# Altium schematic sheet RK3562-POWER-GND.SchDoc
size 299 x 209 mm; SheetNumber: 4; SheetTotal: 32
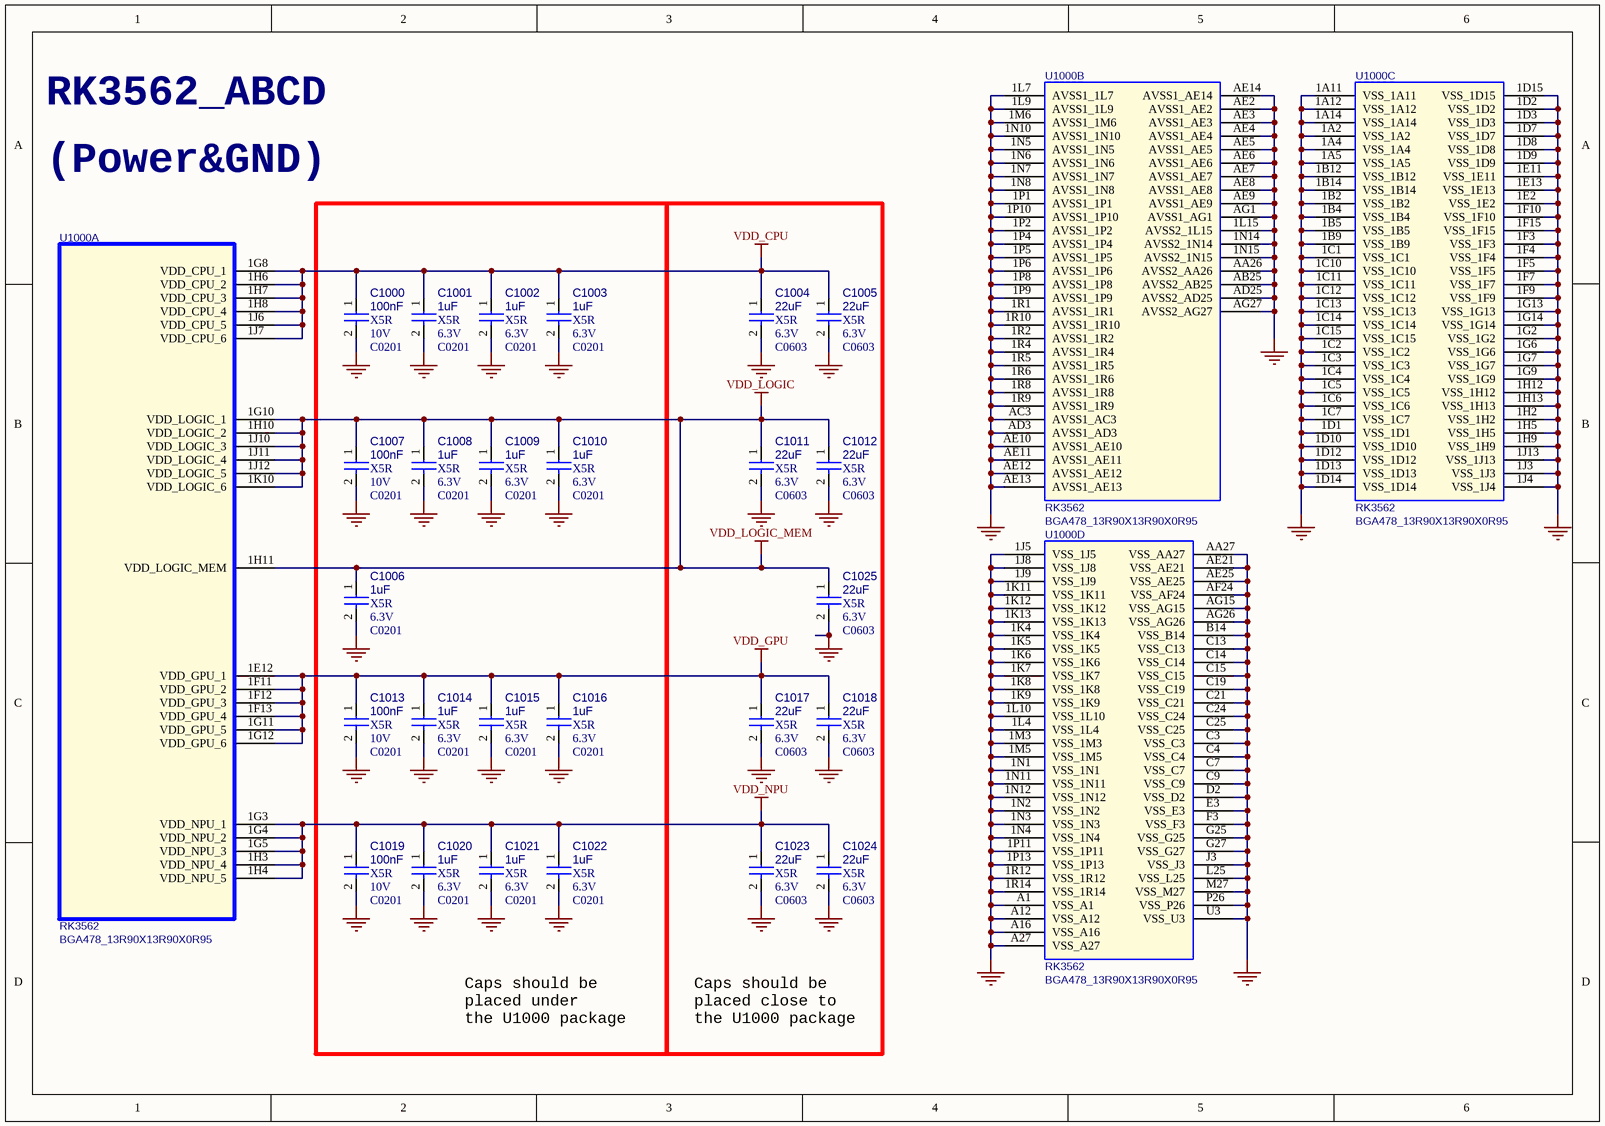
[diagram p0: RK3562-POWER-GND.SchDoc]

## Parts
C1000  100nF  Dielectric: X5R  Voltage: 10V  [C0201]
C1001  1uF  Dielectric: X5R  Voltage: 6.3V  [C0201]
C1002  1uF  Dielectric: X5R  Voltage: 6.3V  [C0201]
C1003  1uF  Dielectric: X5R  Voltage: 6.3V  [C0201]
C1004  22uF  Dielectric: X5R  Voltage: 6.3V  [C0603]
C1005  22uF  Dielectric: X5R  Voltage: 6.3V  [C0603]
C1006  1uF  Dielectric: X5R  Voltage: 6.3V  [C0201]
C1007  100nF  Dielectric: X5R  Voltage: 10V  [C0201]
C1008  1uF  Dielectric: X5R  Voltage: 6.3V  [C0201]
C1009  1uF  Dielectric: X5R  Voltage: 6.3V  [C0201]
C1010  1uF  Dielectric: X5R  Voltage: 6.3V  [C0201]
C1011  22uF  Dielectric: X5R  Voltage: 6.3V  [C0603]
C1012  22uF  Dielectric: X5R  Voltage: 6.3V  [C0603]
C1013  100nF  Dielectric: X5R  Voltage: 10V  [C0201]
C1014  1uF  Dielectric: X5R  Voltage: 6.3V  [C0201]
C1015  1uF  Dielectric: X5R  Voltage: 6.3V  [C0201]
C1016  1uF  Dielectric: X5R  Voltage: 6.3V  [C0201]
C1017  22uF  Dielectric: X5R  Voltage: 6.3V  [C0603]
C1018  22uF  Dielectric: X5R  Voltage: 6.3V  [C0603]
C1019  100nF  Dielectric: X5R  Voltage: 10V  [C0201]
C1020  1uF  Dielectric: X5R  Voltage: 6.3V  [C0201]
C1021  1uF  Dielectric: X5R  Voltage: 6.3V  [C0201]
C1022  1uF  Dielectric: X5R  Voltage: 6.3V  [C0201]
C1023  22uF  Dielectric: X5R  Voltage: 6.3V  [C0603]
C1024  22uF  Dielectric: X5R  Voltage: 6.3V  [C0603]
C1025  22uF  Dielectric: X5R  Voltage: 6.3V  [C0603]
U1000  RK3562  [BGA478_13R90X13R90X0R95]  (parts A,B,C,D of 16)

## Nets
GND: C1000.2 C1001.2 C1002.2 C1003.2 C1004.2 C1005.2 C1006.2 C1007.2 C1008.2 C1009.2 C1010.2 C1011.2 C1012.2 C1013.2 C1014.2 C1015.2 C1016.2 C1017.2 C1018.2 C1019.2 C1020.2 C1021.2 C1022.2 C1023.2 C1024.2 C1025.2 U1000.1A2(VSS_1A2) U1000.1A4(VSS_1A4) U1000.1A5(VSS_1A5) U1000.1A11(VSS_1A11) U1000.1A12(VSS_1A12) U1000.1A14(VSS_1A14) U1000.1B2(VSS_1B2) U1000.1B4(VSS_1B4) U1000.1B5(VSS_1B5) U1000.1B9(VSS_1B9) U1000.1B12(VSS_1B12) U1000.1B14(VSS_1B14) U1000.1C1(VSS_1C1) U1000.1C2(VSS_1C2) U1000.1C3(VSS_1C3) U1000.1C4(VSS_1C4) U1000.1C5(VSS_1C5) U1000.1C6(VSS_1C6) U1000.1C7(VSS_1C7) U1000.1C10(VSS_1C10) U1000.1C11(VSS_1C11) U1000.1C12(VSS_1C12) U1000.1C13(VSS_1C13) U1000.1C14(VSS_1C14) U1000.1C15(VSS_1C15) U1000.1D1(VSS_1D1) U1000.1D2(VSS_1D2) U1000.1D3(VSS_1D3) U1000.1D7(VSS_1D7) U1000.1D8(VSS_1D8) U1000.1D9(VSS_1D9) U1000.1D10(VSS_1D10) U1000.1D12(VSS_1D12) U1000.1D13(VSS_1D13) U1000.1D14(VSS_1D14) U1000.1D15(VSS_1D15) U1000.1E2(VSS_1E2) U1000.1E11(VSS_1E11) U1000.1E13(VSS_1E13) U1000.1F3(VSS_1F3) U1000.1F4(VSS_1F4) U1000.1F5(VSS_1F5) U1000.1F7(VSS_1F7) U1000.1F9(VSS_1F9) U1000.1F10(VSS_1F10) U1000.1F15(VSS_1F15) U1000.1G2(VSS_1G2) U1000.1G6(VSS_1G6) U1000.1G7(VSS_1G7) U1000.1G9(VSS_1G9) U1000.1G13(VSS_1G13) U1000.1G14(VSS_1G14) U1000.1H2(VSS_1H2) U1000.1H5(VSS_1H5) U1000.1H9(VSS_1H9) U1000.1H12(VSS_1H12) U1000.1H13(VSS_1H13) U1000.1J3(VSS_1J3) U1000.1J4(VSS_1J4) U1000.1J5(VSS_1J5) U1000.1J8(VSS_1J8) U1000.1J9(VSS_1J9) U1000.1J13(VSS_1J13) U1000.1K4(VSS_1K4) U1000.1K5(VSS_1K5) U1000.1K6(VSS_1K6) U1000.1K7(VSS_1K7) U1000.1K8(VSS_1K8) U1000.1K9(VSS_1K9) U1000.1K11(VSS_1K11) U1000.1K12(VSS_1K12) U1000.1K13(VSS_1K13) U1000.1L4(VSS_1L4) U1000.1L7(AVSS1_1L7) U1000.1L9(AVSS1_1L9) U1000.1L10(VSS_1L10) U1000.1L15(AVSS2_1L15) U1000.1M3(VSS_1M3) U1000.1M5(VSS_1M5) U1000.1M6(AVSS1_1M6) U1000.1N1(VSS_1N1) U1000.1N2(VSS_1N2) U1000.1N3(VSS_1N3) U1000.1N4(VSS_1N4) U1000.1N5(AVSS1_1N5) U1000.1N6(AVSS1_1N6) U1000.1N7(AVSS1_1N7) U1000.1N8(AVSS1_1N8) U1000.1N10(AVSS1_1N10) U1000.1N11(VSS_1N11) U1000.1N12(VSS_1N12) U1000.1N14(AVSS2_1N14) U1000.1N15(AVSS2_1N15) U1000.1P1(AVSS1_1P1) U1000.1P2(AVSS1_1P2) U1000.1P4(AVSS1_1P4) U1000.1P5(AVSS1_1P5) U1000.1P6(AVSS1_1P6) U1000.1P8(AVSS1_1P8) U1000.1P9(AVSS1_1P9) U1000.1P10(AVSS1_1P10) U1000.1P11(VSS_1P11) U1000.1P13(VSS_1P13) U1000.1R1(AVSS1_1R1) U1000.1R2(AVSS1_1R2) U1000.1R4(AVSS1_1R4) U1000.1R5(AVSS1_1R5) U1000.1R6(AVSS1_1R6) U1000.1R8(AVSS1_1R8) U1000.1R9(AVSS1_1R9) U1000.1R10(AVSS1_1R10) U1000.1R12(VSS_1R12) U1000.1R14(VSS_1R14) U1000.A1(VSS_A1) U1000.A12(VSS_A12) U1000.A16(VSS_A16) U1000.A27(VSS_A27) U1000.AA26(AVSS2_AA26) U1000.AA27(VSS_AA27) U1000.AB25(AVSS2_AB25) U1000.AC3(AVSS1_AC3) U1000.AD3(AVSS1_AD3) U1000.AD25(AVSS2_AD25) U1000.AE2(AVSS1_AE2) U1000.AE3(AVSS1_AE3) U1000.AE4(AVSS1_AE4) U1000.AE5(AVSS1_AE5) U1000.AE6(AVSS1_AE6) U1000.AE7(AVSS1_AE7) U1000.AE8(AVSS1_AE8) U1000.AE9(AVSS1_AE9) U1000.AE10(AVSS1_AE10) U1000.AE11(AVSS1_AE11) U1000.AE12(AVSS1_AE12) U1000.AE13(AVSS1_AE13) U1000.AE14(AVSS1_AE14) U1000.AE21(VSS_AE21) U1000.AE25(VSS_AE25) U1000.AF24(VSS_AF24) U1000.AG1(AVSS1_AG1) U1000.AG15(VSS_AG15) U1000.AG26(VSS_AG26) U1000.AG27(AVSS2_AG27) U1000.B14(VSS_B14) U1000.C3(VSS_C3) U1000.C4(VSS_C4) U1000.C7(VSS_C7) U1000.C9(VSS_C9) U1000.C13(VSS_C13) U1000.C14(VSS_C14) U1000.C15(VSS_C15) U1000.C19(VSS_C19) U1000.C21(VSS_C21) U1000.C24(VSS_C24) U1000.C25(VSS_C25) U1000.D2(VSS_D2) U1000.E3(VSS_E3) U1000.F3(VSS_F3) U1000.G25(VSS_G25) U1000.G27(VSS_G27) U1000.J3(VSS_J3) U1000.L25(VSS_L25) U1000.M27(VSS_M27) U1000.P26(VSS_P26) U1000.U3(VSS_U3)
VDD_CPU: C1000.1 C1001.1 C1002.1 C1003.1 C1004.1 C1005.1 U1000.1G8(VDD_CPU_1) U1000.1H6(VDD_CPU_2) U1000.1H7(VDD_CPU_3) U1000.1H8(VDD_CPU_4) U1000.1J6(VDD_CPU_5) U1000.1J7(VDD_CPU_6)
VDD_GPU: C1013.1 C1014.1 C1015.1 C1016.1 C1017.1 C1018.1 U1000.1E12(VDD_GPU_1) U1000.1F11(VDD_GPU_2) U1000.1F12(VDD_GPU_3) U1000.1F13(VDD_GPU_4) U1000.1G11(VDD_GPU_5) U1000.1G12(VDD_GPU_6)
VDD_LOGIC: C1006.1 C1007.1 C1008.1 C1009.1 C1010.1 C1011.1 C1012.1 C1025.1 U1000.1G10(VDD_LOGIC_1) U1000.1H10(VDD_LOGIC_2) U1000.1H11(VDD_LOGIC_MEM) U1000.1J10(VDD_LOGIC_3) U1000.1J11(VDD_LOGIC_4) U1000.1J12(VDD_LOGIC_5) U1000.1K10(VDD_LOGIC_6)  [also labelled VDD_LOGIC_MEM]
VDD_NPU: C1019.1 C1020.1 C1021.1 C1022.1 C1023.1 C1024.1 U1000.1G3(VDD_NPU_1) U1000.1G4(VDD_NPU_2) U1000.1G5(VDD_NPU_3) U1000.1H3(VDD_NPU_4) U1000.1H4(VDD_NPU_5)

## Notes on the sheet
- RK3562_ABCD
- (Power&GND)
- Caps should be
  placed under
  the U1000 package
- Caps should be
  placed close to
  the U1000 package

## Library data of the parts
C1000 = CAP NP: cap,100.00nF,+/-10%,10V,X5R,C0201; Part Reference: C1000; Manufacturer PN: C0603X5R1A104K030BC; Manufacturer: TDK; Tolerance: 10%; Priority: A; PCB Footprint: C0201; Value: 100nF; Created by: JJJ; Part Type: C0201; RK PN: C0603X5R1A104K030BC; ClassName: RK
C1001 = CAP NP: cap,1.00uF,+/-20%,6.3V,X5R,C0201; Part Reference: C1001; Manufacturer: TDK; RK PN: C0603X5R0J105M030BC; Priority: A; Tolerance: 20%; PCB Footprint: C0201; Value: 1uF; Part Type: C0201; Manufacturer PN: C0603X5R0J105M030BC; Created by: JJJ; ClassName: RK
C1002 = CAP NP: cap,1.00uF,+/-20%,6.3V,X5R,C0201; Part Reference: C1002; Manufacturer PN: C0603X5R0J105M030BC; Manufacturer: TDK; Tolerance: 20%; Priority: A; PCB Footprint: C0201; Value: 1uF; Created by: JJJ; Part Type: C0201; RK PN: C0603X5R0J105M030BC; ClassName: RK
C1003 = CAP NP: cap,1.00uF,+/-20%,6.3V,X5R,C0201; Part Reference: C1003; Manufacturer PN: C0603X5R0J105M030BC; Manufacturer: TDK; Tolerance: 20%; Priority: A; PCB Footprint: C0201; Value: 1uF; Created by: JJJ; Part Type: C0201; RK PN: C0603X5R0J105M030BC; ClassName: RK
C1004 = CAP NP: cap,22.00uF,+/-20%,6.3V,X5R,C0603; Part Reference: C1004; Manufacturer PN: C1608X5R0J226M080AC; Manufacturer: TDK; Tolerance: 20%; Priority: A; PCB Footprint: C0603; Value: 22uF; Created by: JJJ; C_Voltage: 6.3V; Part Type: C0603; RK PN: C1608X5R0J226M080AC; ClassName: RK
C1005 = CAP NP: cap,22.00uF,+/-20%,6.3V,X5R,C0603; Part Reference: C1005; Manufacturer PN: C1608X5R0J226M080AC; Manufacturer: TDK; Tolerance: 20%; Priority: A; PCB Footprint: C0603; Value: 22uF; Created by: JJJ; C_Voltage: 6.3V; Part Type: C0603; RK PN: C1608X5R0J226M080AC; ClassName: RK
C1006 = CAP NP: cap,1.00uF,+/-20%,6.3V,X5R,C0201; Part Reference: C1006; Manufacturer PN: C0603X5R0J105M030BC; Manufacturer: TDK; Tolerance: 20%; Priority: A; PCB Footprint: C0201; Value: 1uF; Created by: JJJ; Part Type: C0201; RK PN: C0603X5R0J105M030BC; ClassName: RK
C1007 = CAP NP: cap,100.00nF,+/-10%,10V,X5R,C0201; Part Reference: C1007; Manufacturer PN: C0603X5R1A104K030BC; Manufacturer: TDK; Tolerance: 10%; Priority: A; PCB Footprint: C0201; Value: 100nF; Created by: JJJ; Part Type: C0201; RK PN: C0603X5R1A104K030BC; ClassName: RK
C1008 = CAP NP: cap,1.00uF,+/-20%,6.3V,X5R,C0201; Part Reference: C1008; Manufacturer: TDK; RK PN: C0603X5R0J105M030BC; Priority: A; Tolerance: 20%; PCB Footprint: C0201; Value: 1uF; Part Type: C0201; Manufacturer PN: C0603X5R0J105M030BC; Created by: JJJ; ClassName: RK
C1009 = CAP NP: cap,1.00uF,+/-20%,6.3V,X5R,C0201; Part Reference: C1009; Manufacturer PN: C0603X5R0J105M030BC; Manufacturer: TDK; Tolerance: 20%; Priority: A; PCB Footprint: C0201; Value: 1uF; Created by: JJJ; Part Type: C0201; RK PN: C0603X5R0J105M030BC; ClassName: RK
C1010 = CAP NP: cap,1.00uF,+/-20%,6.3V,X5R,C0201; Part Reference: C1010; Manufacturer PN: C0603X5R0J105M030BC; Manufacturer: TDK; Tolerance: 20%; Priority: A; PCB Footprint: C0201; Value: 1uF; Created by: JJJ; Part Type: C0201; RK PN: C0603X5R0J105M030BC; ClassName: RK
C1011 = CAP NP: cap,22.00uF,+/-20%,6.3V,X5R,C0603; Part Reference: C1011; Manufacturer PN: C1608X5R0J226M080AC; Manufacturer: TDK; Tolerance: 20%; Priority: A; PCB Footprint: C0603; Value: 22uF; Created by: JJJ; C_Voltage: 6.3V; Part Type: C0603; RK PN: C1608X5R0J226M080AC; ClassName: RK
C1012 = CAP NP: cap,22.00uF,+/-20%,6.3V,X5R,C0603; Part Reference: C1012; Manufacturer PN: C1608X5R0J226M080AC; Manufacturer: TDK; Tolerance: 20%; Priority: A; PCB Footprint: C0603; Value: 22uF; Created by: JJJ; C_Voltage: 6.3V; Part Type: C0603; RK PN: C1608X5R0J226M080AC; ClassName: RK
C1013 = CAP NP: cap,100.00nF,+/-10%,10V,X5R,C0201; Part Reference: C1013; Manufacturer PN: C0603X5R1A104K030BC; Manufacturer: TDK; Tolerance: 10%; Priority: A; PCB Footprint: C0201; Value: 100nF; Created by: JJJ; Part Type: C0201; RK PN: C0603X5R1A104K030BC; ClassName: RK
C1014 = CAP NP: cap,1.00uF,+/-20%,6.3V,X5R,C0201; Part Reference: C1014; Manufacturer: TDK; RK PN: C0603X5R0J105M030BC; Priority: A; Tolerance: 20%; PCB Footprint: C0201; Value: 1uF; Part Type: C0201; Manufacturer PN: C0603X5R0J105M030BC; Created by: JJJ; ClassName: RK
C1015 = CAP NP: cap,1.00uF,+/-20%,6.3V,X5R,C0201; Part Reference: C1015; Manufacturer PN: C0603X5R0J105M030BC; Manufacturer: TDK; Tolerance: 20%; Priority: A; PCB Footprint: C0201; Value: 1uF; Created by: JJJ; Part Type: C0201; RK PN: C0603X5R0J105M030BC; ClassName: RK
C1016 = CAP NP: cap,1.00uF,+/-20%,6.3V,X5R,C0201; Part Reference: C1016; Manufacturer PN: C0603X5R0J105M030BC; Manufacturer: TDK; Tolerance: 20%; Priority: A; PCB Footprint: C0201; Value: 1uF; Created by: JJJ; Part Type: C0201; RK PN: C0603X5R0J105M030BC; ClassName: RK
C1017 = CAP NP: cap,22.00uF,+/-20%,6.3V,X5R,C0603; Part Reference: C1017; Manufacturer PN: C1608X5R0J226M080AC; Manufacturer: TDK; Tolerance: 20%; Priority: A; PCB Footprint: C0603; Value: 22uF; Created by: JJJ; C_Voltage: 6.3V; Part Type: C0603; RK PN: C1608X5R0J226M080AC; ClassName: RK
C1018 = CAP NP: cap,22.00uF,+/-20%,6.3V,X5R,C0603; Part Reference: C1018; Manufacturer PN: C1608X5R0J226M080AC; Manufacturer: TDK; Tolerance: 20%; Priority: A; PCB Footprint: C0603; Value: 22uF; Created by: JJJ; C_Voltage: 6.3V; Part Type: C0603; RK PN: C1608X5R0J226M080AC; ClassName: RK
C1019 = CAP NP: cap,100.00nF,+/-10%,10V,X5R,C0201; Part Reference: C1019; Manufacturer PN: C0603X5R1A104K030BC; Manufacturer: TDK; Tolerance: 10%; Priority: A; PCB Footprint: C0201; Value: 100nF; Created by: JJJ; Part Type: C0201; RK PN: C0603X5R1A104K030BC; ClassName: RK
C1020 = CAP NP: cap,1.00uF,+/-20%,6.3V,X5R,C0201; Part Reference: C1020; Manufacturer: TDK; RK PN: C0603X5R0J105M030BC; Priority: A; Tolerance: 20%; PCB Footprint: C0201; Value: 1uF; Part Type: C0201; Manufacturer PN: C0603X5R0J105M030BC; Created by: JJJ; ClassName: RK
C1021 = CAP NP: cap,1.00uF,+/-20%,6.3V,X5R,C0201; Part Reference: C1021; Manufacturer PN: C0603X5R0J105M030BC; Manufacturer: TDK; Tolerance: 20%; Priority: A; PCB Footprint: C0201; Value: 1uF; Created by: JJJ; Part Type: C0201; RK PN: C0603X5R0J105M030BC; ClassName: RK
C1022 = CAP NP: cap,1.00uF,+/-20%,6.3V,X5R,C0201; Part Reference: C1022; Manufacturer: TDK; RK PN: C0603X5R0J105M030BC; Priority: A; Tolerance: 20%; PCB Footprint: C0201; Value: 1uF; Part Type: C0201; Manufacturer PN: C0603X5R0J105M030BC; Created by: JJJ; ClassName: RK
C1023 = CAP NP: cap,22.00uF,+/-20%,6.3V,X5R,C0603; Part Reference: C1023; Manufacturer PN: C1608X5R0J226M080AC; Manufacturer: TDK; Tolerance: 20%; Priority: A; PCB Footprint: C0603; Value: 22uF; Created by: JJJ; C_Voltage: 6.3V; Part Type: C0603; RK PN: C1608X5R0J226M080AC; ClassName: RK
C1024 = CAP NP: cap,22.00uF,+/-20%,6.3V,X5R,C0603; Part Reference: C1024; Manufacturer PN: C1608X5R0J226M080AC; Manufacturer: TDK; Tolerance: 20%; Priority: A; PCB Footprint: C0603; Value: 22uF; Created by: JJJ; C_Voltage: 6.3V; Part Type: C0603; RK PN: C1608X5R0J226M080AC; ClassName: RK
C1025 = CAP NP: cap,22.00uF,+/-20%,6.3V,X5R,C0603; Part Reference: C1025; Manufacturer: TDK; RK PN: C1608X5R0J226M080AC; Priority: A; Tolerance: 20%; PCB Footprint: C0603; Value: 22uF; Part Type: C0603; C_Voltage: 6.3V; Manufacturer PN: C1608X5R0J226M080AC; Created by: JJJ; ClassName: RK
U1000 = SOC_RK3562: ROCKCHIP SOC; Part Reference: U1000; Manufacturer: Rockchip (瑞芯微); SPLIT_INST: TRUE; SWAP_INFO: (S1+S2+S3+S4+S5+S6+S7+S8+S9+S10+S11+S12+S13+S14+S15+S16); Priority: A; RK PN: 906000425; PCB Footprint: BGA478_13R90X13R90X0R95; Value: RK3562; Created by: JJJ; Manufacturer PN: RK3562; Part Type: SOC; ClassName: RK